# EasyEDA Pro project ProProject_无线温湿度检测系统1_2024-10-27.epro, schematic Schematic1
Create Date: 2023-11-22; Page Name: P1; Project Name: 无线温湿度检测系统1; Schematic Name: Schematic1; Update Date: 2024-02-20; Company: 嘉立创EDA; Page Size: A4; Version: V1.0
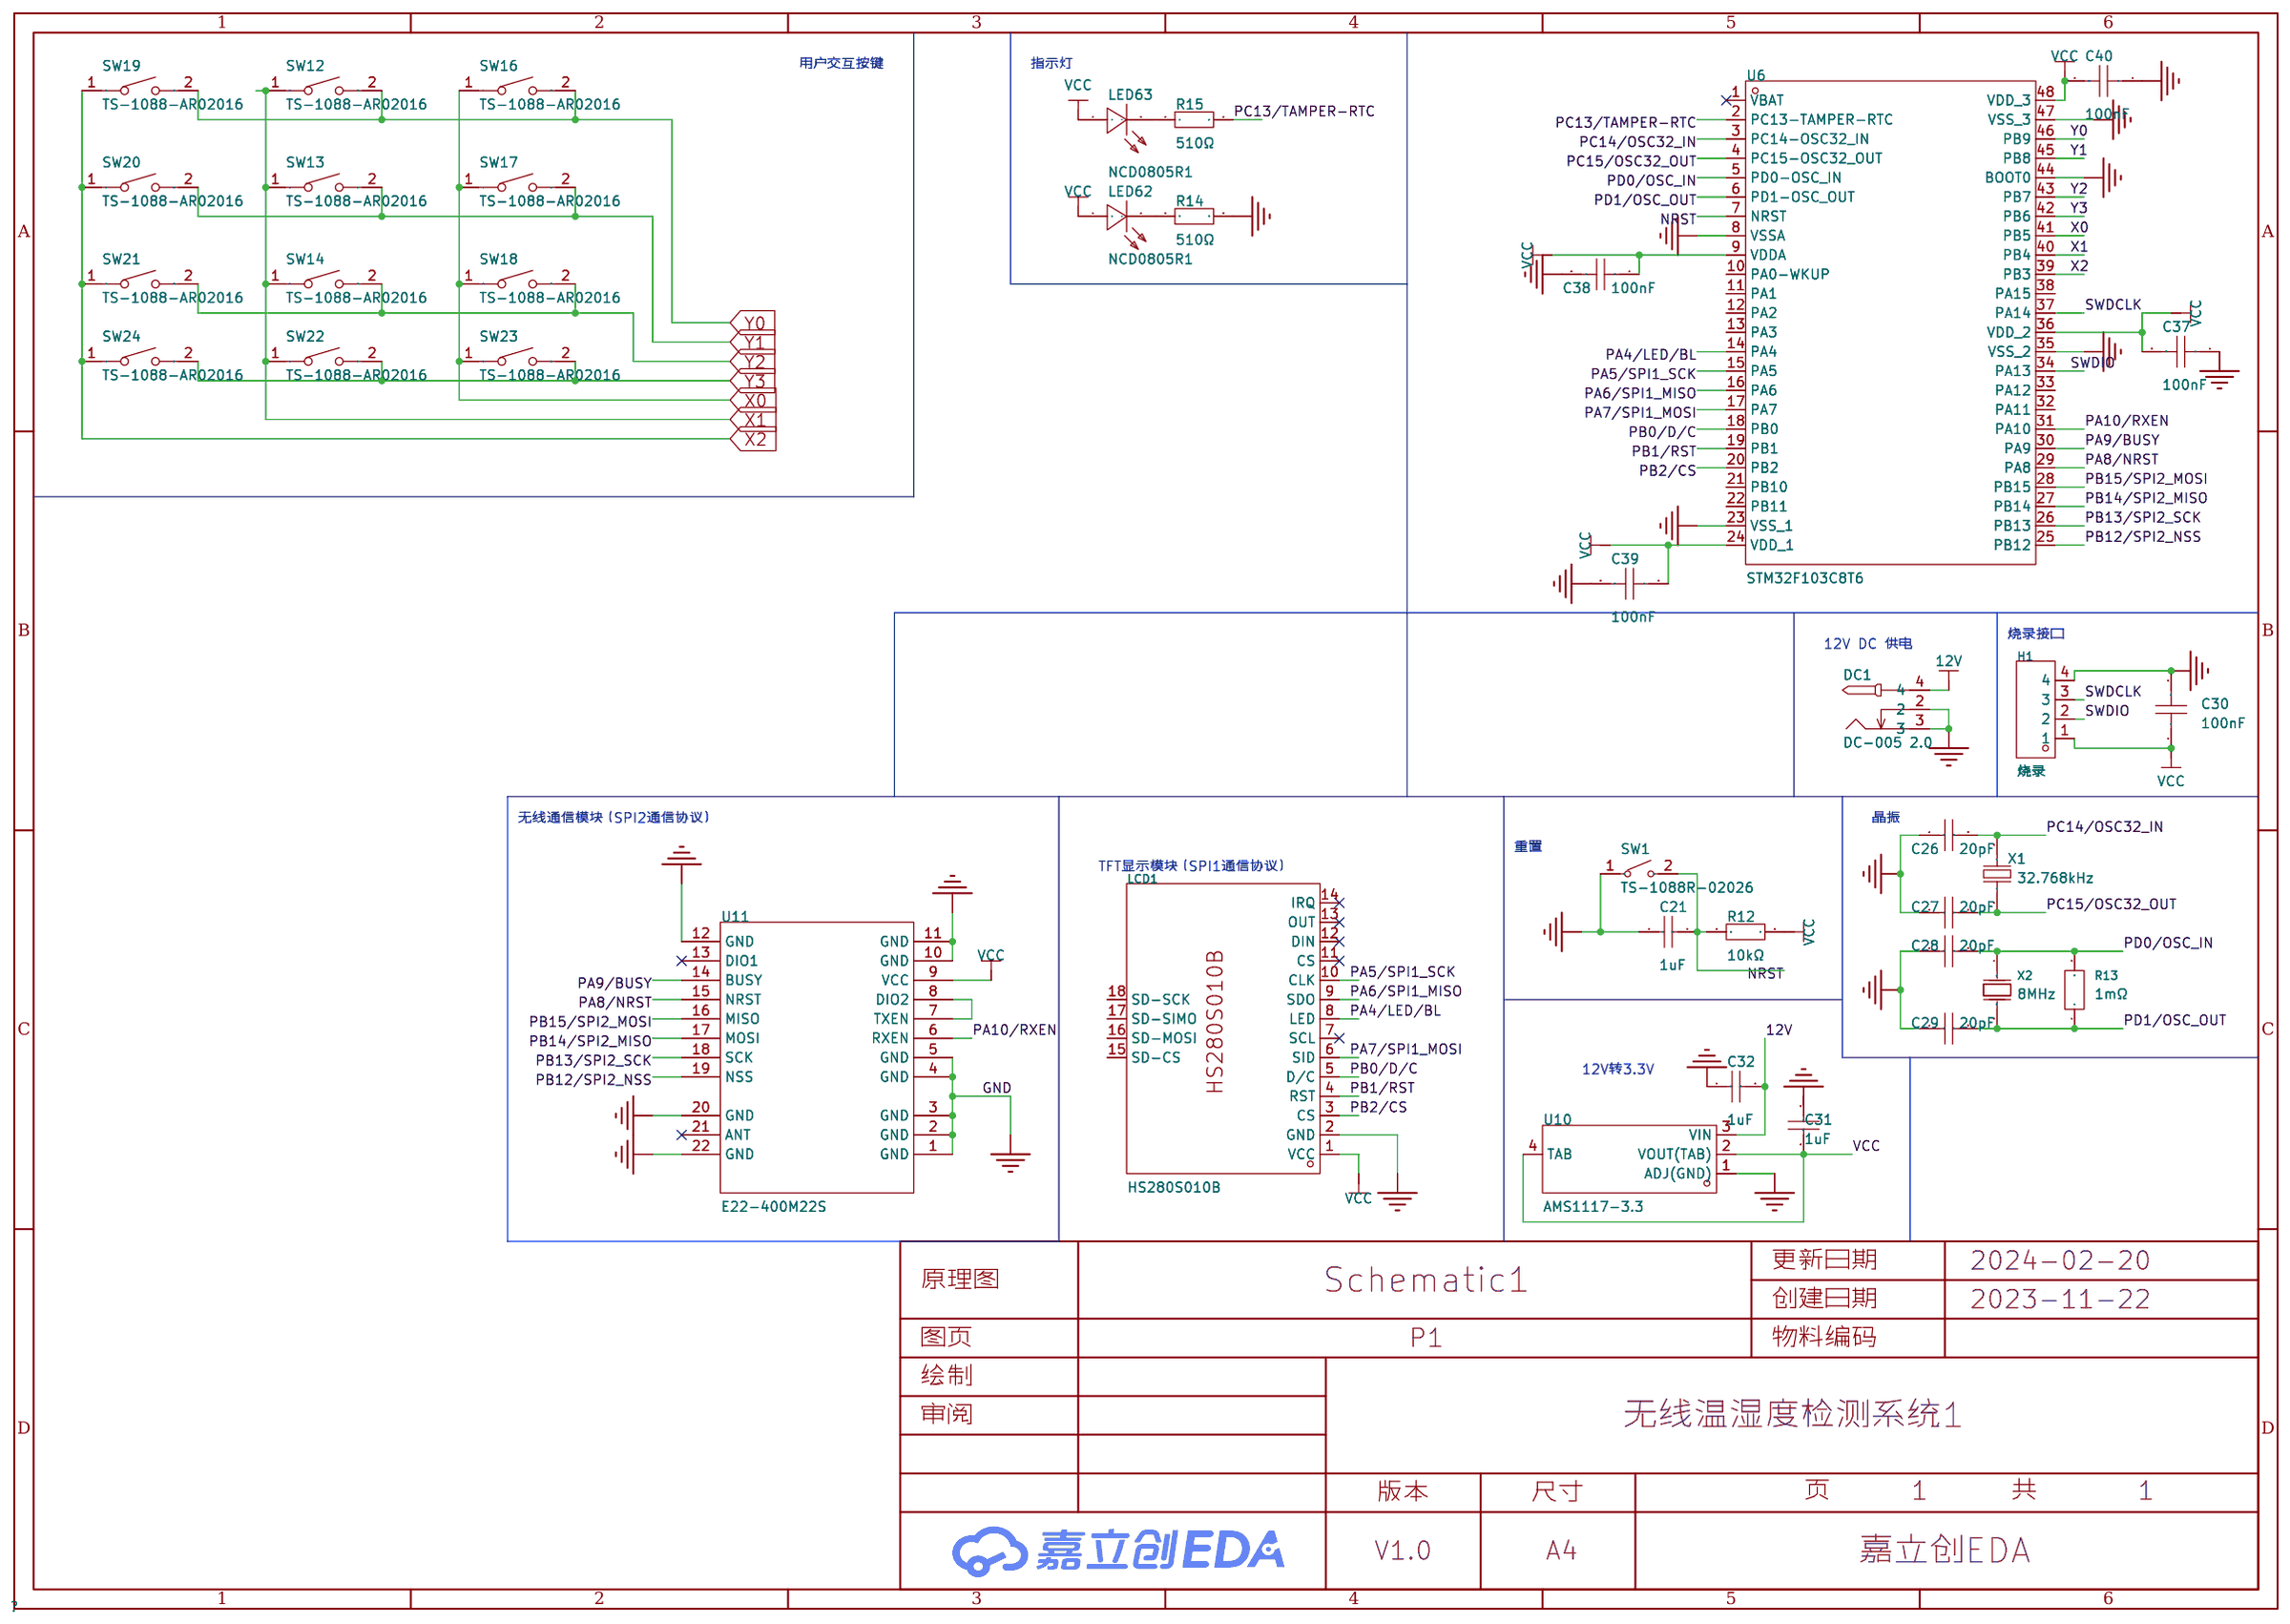
[diagram p0: schematic sheet]

## Parts
C21  1uF  [C0603]
C26  20pF  [C0603]
C27  20pF  [C0603]
C28  20pF  [C0603]
C29  20pF  [C0603]
C30  100nF  [C0603]
C31  1uF  [C0603]
C32  1uF  [C0603]
C37  100nF  [C0603]
C38  100nF  [C0603]
C39  100nF  [C0603]
C40  100nF  [C0603]
DC1  DC-005 2.0  [DC-IN-TH_DC-5520-1]
H1  烧录  [HDR-TH_4P-P2.54-V-M]
LCD1  HS280S010B  [LCD-TH_HS280S010B]
LED62  NCD0805R1  [LED0805-R-RD]
LED63  NCD0805R1  [LED0805-R-RD]
R12  10kΩ  [R0603]
R13  1mΩ  [R1206]
R14  510Ω  [R0603]
R15  510Ω  [R0603]
SW1  TS-1088R-02026  [SW-SMD_L3.9-W3.0-P4.45]
SW12  TS-1088-AR02016  [SW-SMD_L3.9-W3.0-P4.45]
SW13  TS-1088-AR02016  [SW-SMD_L3.9-W3.0-P4.45]
SW14  TS-1088-AR02016  [SW-SMD_L3.9-W3.0-P4.45]
SW16  TS-1088-AR02016  [SW-SMD_L3.9-W3.0-P4.45]
SW17  TS-1088-AR02016  [SW-SMD_L3.9-W3.0-P4.45]
SW18  TS-1088-AR02016  [SW-SMD_L3.9-W3.0-P4.45]
SW19  TS-1088-AR02016  [SW-SMD_L3.9-W3.0-P4.45]
SW20  TS-1088-AR02016  [SW-SMD_L3.9-W3.0-P4.45]
SW21  TS-1088-AR02016  [SW-SMD_L3.9-W3.0-P4.45]
SW22  TS-1088-AR02016  [SW-SMD_L3.9-W3.0-P4.45]
SW23  TS-1088-AR02016  [SW-SMD_L3.9-W3.0-P4.45]
SW24  TS-1088-AR02016  [SW-SMD_L3.9-W3.0-P4.45]
U6  STM32F103C8T6  [LQFP-48_L7.0-W7.0-P0.50-LS9.0-BL]
U10  AMS1117-3.3  [SOT-223-4_L6.5-W3.5-P2.30-LS7.0-BR]
U11  E22-400M22S  [WIRELM-SMD_E22-400M22S]
X1  32.768kHz  [FC-135R_L3.2-W1.5]
X2  8MHz  [CRYSTAL-SMD_L11.5-W4.8-LS12.7]

## Library data of the parts
C21 C31 C32 = CL10A105KB8NNNC: 容值:1uF;精度:±10%;额定电压:50V;材质(温度系数):X5R;; LCSC Part Name: 1uF ±10% 50V; Supplier Part: C15849; Manufacturer: SAMSUNG(三星); Supplier Footprint: 0603; JLCPCB Part Class: Basic Part; Datasheet: https://atta.szlcsc.com/upload/public/pdf/source/20160103/1457707679084.pdf; Supplier: LCSC; Tolerance: ±10%; Voltage Rated: 50V; Temperature Coefficient: X5R
C26-C29 = CC0603JRNPO9BN200: 容值:20pF;精度:±5%;额定电压:50V;材质(温度系数):NP0;; LCSC Part Name: 20pF ±5% 50V; Supplier Part: C105621; Manufacturer: YAGEO(国巨); Supplier Footprint: 0603; JLCPCB Part Class: Extended Part; Datasheet: https://atta.szlcsc.com/upload/public/pdf/source/20170425/1493115771885.pdf; Supplier: LCSC; Tolerance: ±5%; Voltage Rated: 50V; Temperature Coefficient: NP0
C30 C37-C40 = CC0603KRX7R9BB104: 容值:100nF;精度:±10%;额定电压:50V;材质(温度系数):X7R;; LCSC Part Name: 100nF ±10% 50V; Supplier Part: C14663; Manufacturer: YAGEO(国巨); Supplier Footprint: 0603; JLCPCB Part Class: Basic Part; Datasheet: https://atta.szlcsc.com/upload/public/pdf/source/20180910/C282072_33301C7F631E79921B82A8DAC6BCC5B3.pdf; Supplier: LCSC; Tolerance: ±10%; Voltage Rated: 50V; Temperature Coefficient: X7R
DC1 = DC-005 2.0: 连接器类型:DC电源插座;安装方式:弯插;触点内径:2mm;触点外径:6.4mm;额定电流:-;额定电压:-;工作温度范围:-;; LCSC Part Name: DC电源插座 内径:2mm 外径:6.4mm 铁材质; Supplier Part: C16214; Manufacturer: BOOMELE(博穆精密); Supplier Footprint: 插件; JLCPCB Part Class: 扩展库; Datasheet: https://atta.szlcsc.com/upload/public/pdf/source/20190827/C16214_DA59F99E888FED58D9833F5341D610B0.pdf; Supplier: LCSC; Connector Type: DC电源插座; Mounting Style: 弯插; Inside Contact Diameter: 2mm; Outside Contact Diameter: 6.4mm
H1 = PZ254V-11-04P: 排数:单排;总PIN位数:4P;间距:2.54mm;插针结构:1x4P;行距:-;安装类型:直插;圆针/方针:方针;额定电流:3A;额定电压:250V;配合针长度:6mm;塑高:2.5mm;端接针长度:3mm;触头材质:-;工作温度范围:-40℃~+105℃;颜色:黑色;; LCSC Part Name: 2.54mm 1x4P 直插 方针; Supplier Part: C2691448; Manufacturer: XFCN(兴飞); Supplier Footprint: 插件,P=2.54mm; JLCPCB Part Class: Extended Part; Datasheet: https://atta.szlcsc.com/upload/public/pdf/source/20200309/C492403_F9F19131791D08044AD4F84F8E751A34.pdf; Supplier: LCSC; Number of Rows: 单排; Number of Pins: 4P; Pitch: 2.54mm; Pin Structure: 1x4P; Mounting Type: 直插; Circluar Pins/Square Pins: 方针; Current Rating (Max): 3A; Voltage Rating (Max): 250V; Length of Mating Pin: 6mm; Insulation Height: 2.5mm; Length of End Connection Pin: 3mm; Operating Temperature Range: -40℃~+105℃; Color: 黑色
LCD1 = HS280S010B: 尺寸(inch):2.8;主控芯片:ST7789V;; LCSC Part Name: 2.8寸TFT-LCD液晶屏LCM显示屏; Supplier Part: C2939938; Manufacturer: HS(汉昇); JLCPCB Part Class: 扩展库; Datasheet: https://atta.szlcsc.com/upload/public/pdf/source/20220301/BE70A47BD1B5FAAC1B1134425FD228F4.pdf; Supplier: LCSC; Size: 2.8; Main Control Chip: ST7789V
LED62 LED63 = NCD0805R1: 发光颜色:红灯;; LCSC Part Name: 红灯; Supplier Part: C84256; Manufacturer: 国星光电; Supplier Footprint: 0805; JLCPCB Part Class: Basic Part; Datasheet: https://atta.szlcsc.com/upload/public/pdf/source/20200820/C84256_F0A75A43B3EAD75808600A0514C76B99.pdf; Supplier: LCSC; Emitted Color: 红灯
R12 = 0603WAF1002T5E: 电阻类型:厚膜电阻;阻值:10kΩ;精度:±1%;功率:100mW;; LCSC Part Name: 厚膜电阻 10kΩ ±1% 100mW; Supplier Part: C25804; Manufacturer: UNI-ROYAL(厚声); Supplier Footprint: 0603; JLCPCB Part Class: 基础库; Datasheet: https://atta.szlcsc.com/upload/public/pdf/source/20200306/C422600_1E6D84923E4A46A82E41ADD87F860B5C.pdf; Supplier: LCSC; Type: 厚膜电阻; Tolerance: ±1%; Power(Watts): 100mW; Temperature Coefficient: ±100ppm/℃; Overload Voltage (Max): 75V; Operating Temperature Range: -55℃~+155℃
R13 = PA1206FRF470R001L: 阻值:1mΩ;精度:±1%;功率:1W;温度系数:±100ppm/℃;; LCSC Part Name: 1mΩ ±1% 1W; Supplier Part: C728283; Manufacturer: YAGEO(国巨); Supplier Footprint: 1206; JLCPCB Part Class: Extended Part; Datasheet: https://atta.szlcsc.com/upload/public/pdf/source/20201130/C728283_855FA66FAF64914AE12930520DBED2DB.pdf; Supplier: LCSC; Tolerance: ±1%; Power(Watts): 1W; Temperature Coefficient: ±100ppm/℃; Operating Temperature Range: -55℃~+170℃
R14 R15 = 0603WAF5100T5E: 电阻类型:厚膜电阻;阻值:510Ω;精度:±1%;功率:100mW;; LCSC Part Name: 510Ω ±1% 100mW; Supplier Part: C23193; Manufacturer: UNI-ROYAL(厚声); Supplier Footprint: 0603; JLCPCB Part Class: Basic Part; Datasheet: https://atta.szlcsc.com/upload/public/pdf/source/20200306/C422600_1E6D84923E4A46A82E41ADD87F860B5C.pdf; Supplier: LCSC; Type: 厚膜电阻; Tolerance: ±1%; Power(Watts): 100mW; Temperature Coefficient: ±100ppm/℃; Overload Voltage (Max): 75V; Operating Temperature Range: -55℃~+155℃
SW1 = TS-1088R-02026: 触点电流:50mA;额定电压(DC):12V;电路结构:单刀单掷;安装方式:立贴;带灯:-;机械寿命:-;; LCSC Part Name: 3.9*2.93*2mm 立贴 轻触开关; Supplier Part: C455280; Manufacturer: XUNPU(讯普); Supplier Footprint: SMD,3x4mm; JLCPCB Part Class: Extended Part; Datasheet: https://atta.szlcsc.com/upload/public/pdf/source/20191118/C455280_718CC4284DAF75EEB0AC8229AE7E40C5.pdf; Supplier: LCSC; Contact Current: 50mA; Voltage Rating (DC): 12V; Circuit: 单刀单掷; Mounting Style: 立贴; Actuator Style: 圆形按钮; Switch Length: 3.9mm; Switch Width: 2.93mm; Switch Height: 2mm
SW12-SW14 SW16-SW24 = TS-1088-AR02016: 触点电流:50mA;额定电压(DC):12V;绝缘电阻:100MΩ;电路结构:单刀单掷;安装方式:立贴;作用力:160gf@±50gf;机械寿命:10万次;带支架:否;; LCSC Part Name: 4*3*2mm 立贴 轻触开关; Supplier Part: C720477; Manufacturer: XUNPU(讯普); Supplier Footprint: SMD; JLCPCB Part Class: Extended Part; Datasheet: https://atta.szlcsc.com/upload/public/pdf/source/20200810/C720475_60D09DD6C54279ADDB2DC25100F1CC11.pdf; Supplier: LCSC; Contact Current: 50mA; Voltage Rating (DC): 12V; Insulation Resistance: 100MΩ; Circuit: 单刀单掷; Mounting Style: 立贴; Actuator Style: 圆形按钮; Actuator/Cap Color: 黑色; Operating Force: 160gf@±50gf; Mechanical Life: 10万次; Operating Temperature: -30℃~+80℃; Pin Style: SMD接片; Switch Length: 4mm; Switch Width: 3mm; Switch Height: 2mm; Strike Gundam: 否
U6 = STM32F103C8T6: CPU内核:ARM Cortex-M3;CPU最大主频:72MHz;工作电压范围:2V~3.6V;程序存储容量:64KB;程序存储器类型:FLASH;RAM总容量:20KB;GPIO端口数量:37;; LCSC Part Name: STM32F103C8T6 MSL=3; Supplier Part: C8734; Manufacturer: ST(意法半导体); Supplier Footprint: LQFP-48(7x7); JLCPCB Part Class: 扩展库; Datasheet: https://atta.szlcsc.com/upload/public/pdf/source/20220812/8363ACEC51AD55ECEB84799464F7CB85.pdf; Supplier: LCSC; CPU Core: ARM Cortex-M3; CPU Maximum Speed: 72MHz; Operating Voltage Range: 2V~3.6V; Program Storage Size: 64KB; Program Memory Type: FLASH; RAM Size: 20KB; GPIO Ports Number: 37; ADC (Bit): 12bit; Universal Serial Bus: 有; Peripheral/Function: 看门狗；DMA；看门狗；片载温度传感器; Watchdog: 有; Infrared Data Association: 有; Low-Voltage Detect: 有; Direct Memory Access: 有; Internal Oscillator: 有; Operating Temperature Range: -40℃~+85℃
U10 = AMS1117-3.3_C347222: 输出类型:固定;输出极性:正;最大输入电压:18V;输出电压:3.3V;输出电流:1A;电源纹波抑制比(PSRR):60dB@(120Hz);; LCSC Part Name: 输入18V 输出3.3V 1A; Supplier Part: C347222; Manufacturer: UMW(友台半导体); Supplier Footprint: SOT-223; JLCPCB Part Class: 扩展库; Datasheet: https://atta.szlcsc.com/upload/public/pdf/source/20211011/50CC665C22E3A66C08379A4A74BDA25C.pdf; Supplier: LCSC; Output Type: 固定; Output Polarity: 正; Number of Outputs: 1; Maximum Input Voltage: 18V; Output Voltage: 3.3V; Dropout Voltage: 1.3V@(1A); Output Current: 1A; Power Supply Rejection Ratio (PSRR): 60dB@(120Hz)
U11 = E22-400M22S: SX1262|SX1268+PA新一代LoRa扩频433MHz/470M无线模块SX1278升级; Supplier Part: C411291; Manufacturer: EBYTE(亿佰特); Supplier Footprint: SMD,14.0x20mm; JLCPCB Part Class: 扩展库; Datasheet: https://atta.szlcsc.com/upload/public/pdf/source/20190812/C411291_90FD46F52AC63064ACAA22A31BCCA1DF.pdf; Supplier: LCSC
X1 = Q13FC1350000400: 频率:32.768kHz;频率公差:±20ppm;负载电容:12.5pF;; LCSC Part Name: 32.768kHz ±20ppm 12.5pF; Supplier Part: C32346; Manufacturer: EPSON(爱普生); Supplier Footprint: SMD3215-2P; JLCPCB Part Class: Basic Part; Datasheet: https://atta.szlcsc.com/upload/public/pdf/source/20190108/C32346_746D6B07EAF90824457A96480007685F.pdf; Supplier: LCSC; Crystal Type: 贴片无源晶振; Frequency Tolerance: ±20ppm; Load Capacitance: 12.5pF; Equivalent Series Resistance (ESR): 70kΩ; Operating Temperature: -40℃~+85℃
X2 = X49SM8MSD2SC: 频率:8MHz;频率公差:±20ppm;负载电容:20pF;; LCSC Part Name: 8MHz ±20ppm 20pF HC-49SMD; Supplier Part: C12674; Manufacturer: YXC(扬兴晶振); Supplier Footprint: HC-49S-SMD; JLCPCB Part Class: Basic Part; Datasheet: https://atta.szlcsc.com/upload/public/pdf/source/20210329/C106809_0E91E60850A780B284B63D653DC40EA4.pdf; Supplier: LCSC; Crystal Type: 49SMD; Frequency Tolerance: ±20ppm; Frequency Stability: ±30ppm; Load Capacitance: 20pF; Operating Temperature: -20℃~+70℃

## Nets
12V: C32.2 DC1.4 U10.3(VIN)
GND: C21.1 C26.1 C27.1 C28.1 C29.1 C30.2 C31.1 C32.1 C37.1 C38.2 C39.2 C40.1 DC1.2 DC1.3 H1.4 LCD1.2(GND) R14.2 SW1.1 U6.8(VSSA) U6.23(VSS_1) U6.35(VSS_2) U6.44(BOOT0) U6.47(VSS_3) U10.1(ADJ(GND)) U11.1(GND) U11.2(GND) U11.3(GND) U11.4(GND) U11.5(GND) U11.10(GND) U11.11(GND) U11.12(GND) U11.20(GND) U11.22(GND)
VCC: C30.1 C31.2 C37.2 C38.1 C39.1 C40.2 H1.1 LCD1.1(VCC) LED62.1(+) LED63.1(+) R12.2 U6.9(VDDA) U6.24(VDD_1) U6.36(VDD_2) U6.48(VDD_3) U10.2(VOUT(TAB)) U10.4(TAB) U11.9(VCC)
NRST: C21.2 R12.1 SW1.2 U6.7(NRST)
PA4/LED/BL: LCD1.8(LED) U6.14(PA4)
PA5/SPI1_SCK: LCD1.10(CLK) U6.15(PA5)
PA6/SPI1_MISO: LCD1.9(SDO) U6.16(PA6)
PA7/SPI1_MOSI: LCD1.6(SID) U6.17(PA7)
PA8/NRST: U6.29(PA8) U11.15(NRST)
PA9/BUSY: U6.30(PA9) U11.14(BUSY)
PA10/RXEN: U6.31(PA10) U11.6(RXEN)
PB0/D/C: LCD1.5(D/C) U6.18(PB0)
PB1/RST: LCD1.4(RST) U6.19(PB1)
PB2/CS: LCD1.3(CS) U6.20(PB2)
PB12/SPI2_NSS: U6.25(PB12) U11.19(NSS)
PB13/SPI2_SCK: U6.26(PB13) U11.18(SCK)
PB14/SPI2_MISO: U6.27(PB14) U11.17(MOSI)
PB15/SPI2_MOSI: U6.28(PB15) U11.16(MISO)
PC13/TAMPER-RTC: R15.2 U6.2(PC13-TAMPER-RTC)
PC14/OSC32_IN: C26.2 U6.3(PC14-OSC32_IN) X1.2
PC15/OSC32_OUT: C27.2 U6.4(PC15-OSC32_OUT) X1.1
PD0/OSC_IN: C28.2 R13.2 U6.5(PD0-OSC_IN) X2.1(OSC1)
PD1/OSC_OUT: C29.2 R13.1 U6.6(PD1-OSC_OUT) X2.2(OSC2)
SWDCLK: H1.3 U6.37(PA14)
SWDIO: H1.2 U6.34(PA13)
X0: SW16.1 SW17.1 SW18.1 SW23.1 U6.41(PB5)
X1: SW12.1 SW13.1 SW14.1 SW22.1 U6.40(PB4)
X2: SW19.1 SW20.1 SW21.1 SW24.1 U6.39(PB3)
Y0: SW12.2 SW16.2 SW19.2 U6.46(PB9)
Y1: SW13.2 SW17.2 SW20.2 U6.45(PB8)
Y2: SW14.2 SW18.2 SW21.2 U6.43(PB7)
Y3: SW22.2 SW23.2 SW24.2 U6.42(PB6)
$1N2757: LED62.2(-) R14.1
$1N2758: LED63.2(-) R15.1
$1N20193: U11.7(TXEN) U11.8(DIO2)

Not connected (* = marked no-connect by the designer): LCD1 7(SCL)* 11(CS)* 12(DIN)* 13(OUT)* 14(IRQ)* 15(SD-CS) 16(SD-MOSI) 17(SD-SIMO) 18(SD-SCK); U6 1(VBAT)* 10(PA0-WKUP) 11(PA1) 12(PA2) 13(PA3) 21(PB10) 22(PB11) 32(PA11) 33(PA12) 38(PA15); U11 13(DIO1)* 21(ANT)*

## Notes on the sheet
- 用户交互按键
- 指示灯
- 12V DC 供电
- 烧录接口
- 无线通信模块（SPI2通信协议）
- 晶振
- 重置
- TFT显示模块（SPI1通信协议）
- 12V转3.3V
